# EAGLE design ChannelOutput-x2-opamp (EAGLE 6.5.0)

## Sheet 1 of 3
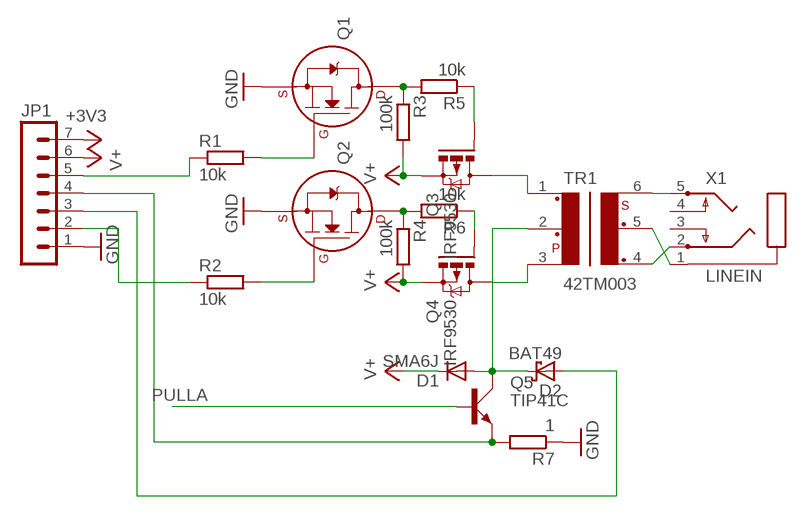
[diagram p0: schematic, sheet 1]

### Parts
D1  SMA6J  1N4004  [DO41-10]
D2  BAT49  [DO41-10]
JP1  MA07-1  [MA07-1]
Q1  2N7000_TO92  [TO-92]
Q2  2N7000_TO92  [TO-92]
Q3  IRF9530  [TO220BV]
Q4  IRF9530  [TO220BV]
Q5  TIP41C  [TO220AV]
R1  10k  R-EU_0207/2V  [0207/2V]
R2  10k  R-EU_0207/2V  [0207/2V]
R3  100k  R-EU_0204/5  [0204/5]
R4  100k  R-EU_0204/5  [0204/5]
R5  10k  R-EU_0207/2V  [0207/2V]
R6  10k  R-EU_0207/2V  [0207/2V]
R7  1  R-EU_0207/2V  [0207/2V]
TR1  42TM003  [42TM]
X1  LINEIN  PG203J  [PG203J]

### Nets
+3V3: JP1.7 ; also sheet 3
GND: JP1.1 Q1.1(S) Q2.1(S) R7.1 ; also sheet 2,3
N$1: Q1.2(G) R1.2
N$2: Q4.G R6.1
N$3: JP1.2 R2.1
N$4: JP1.5 R1.1
N$5: Q4.D TR1.3
N$6: Q3.D TR1.1
N$7: D2.A JP1.3
N$14: JP1.4 Q5.E R7.2
N$48: D1.A D2.C Q5.C TR1.2
N$65: TR1.6 X1.5
N$66: TR1.5 X1.1
N$67: TR1.4 X1.2
N$86: Q2.3(D) R4.1 R6.2
N$88: Q3.G R5.1
N$89: Q1.3(D) R3.1 R5.2
N$93: Q2.2(G) R2.2
PULLA: Q5.B ; also sheet 3
V+: D1.C JP1.6 Q3.S Q4.S R3.2 R4.2 ; also sheet 2
Unconnected: X1.3 X1.4

## Sheet 2 of 3
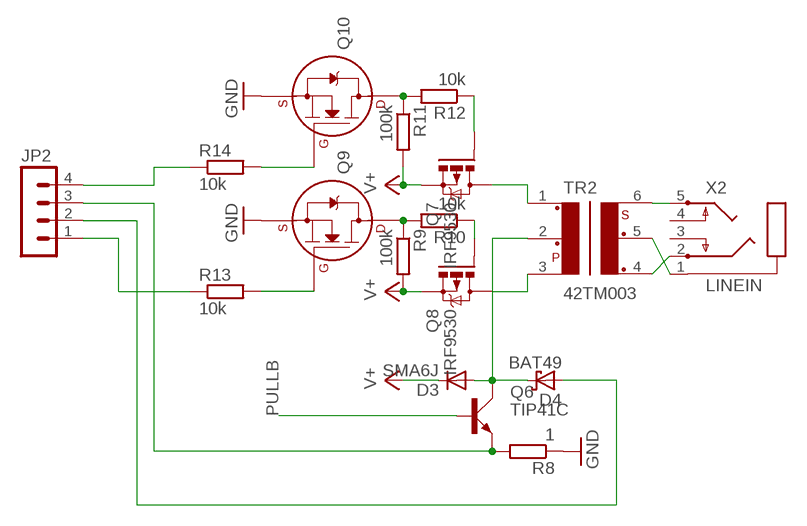
[diagram p1: schematic, sheet 2]

### Parts
D3  SMA6J  1N4004  [DO41-10]
D4  BAT49  [DO41-10]
JP2  MA04-1  [MA04-1]
Q6  TIP41C  [TO220AV]
Q7  IRF9530  [TO220BV]
Q8  IRF9530  [TO220BV]
Q9  2N7000_TO92  [TO-92]
Q10  2N7000_TO92  [TO-92]
R8  1  R-EU_0207/2V  [0207/2V]
R9  100k  R-EU_0204/5  [0204/5]
R10  10k  R-EU_0207/2V  [0207/2V]
R11  100k  R-EU_0204/5  [0204/5]
R12  10k  R-EU_0207/2V  [0207/2V]
R13  10k  R-EU_0207/2V  [0207/2V]
R14  10k  R-EU_0207/2V  [0207/2V]
TR2  42TM003  [42TM]
X2  LINEIN  PG203J  [PG203J]

### Nets
GND: Q9.1(S) Q10.1(S) R8.1 ; also sheet 1,3
N$8: D3.A D4.C Q6.C TR2.2
N$9: TR2.6 X2.5
N$10: TR2.5 X2.1
N$11: TR2.4 X2.2
N$12: JP2.3 Q6.E R8.2
N$13: Q9.3(D) R9.1 R10.2
N$15: Q7.G R12.1
N$16: Q10.3(D) R11.1 R12.2
N$17: Q9.2(G) R13.2
N$18: JP2.4 R14.1
N$19: Q8.G R10.1
N$20: Q10.2(G) R14.2
N$21: JP2.1 R13.1
N$23: Q8.D TR2.3
N$24: Q7.D TR2.1
N$25: D4.A JP2.2
PULLB: Q6.B ; also sheet 3
V+: D3.C Q7.S Q8.S R9.2 R11.2 ; also sheet 1
Unconnected: X2.3 X2.4

## Sheet 3 of 3
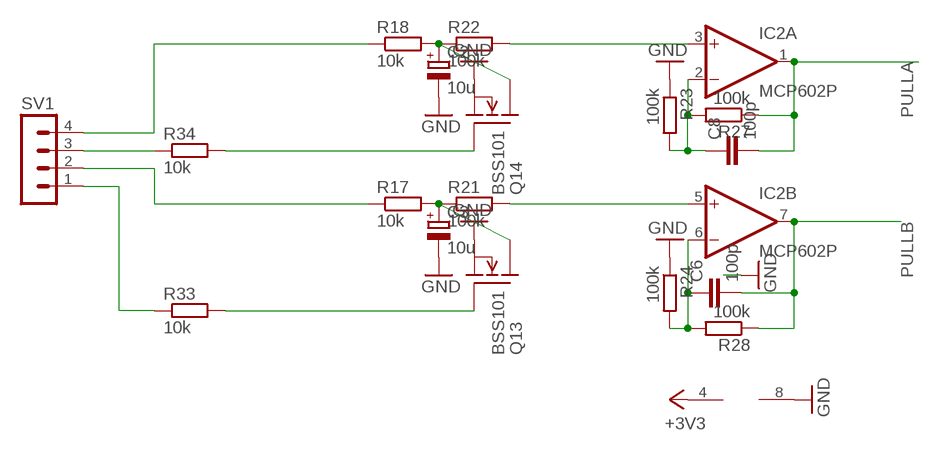
[diagram p2: schematic, sheet 3]

### Parts
C2  10u  CPOL-EUTT2D5  [TT2D5]
C3  10u  CPOL-EUTT2D5  [TT2D5]
C6  100p  C-EU025-024X044  [C025-024X044]
C8  100p  C-EU025-024X044  [C025-024X044]
IC2  MCP602P  [DIL08]
Q13  BSS101  [TO92]
Q14  BSS101  [TO92]
R17  10k  R-EU_0207/2V  [0207/2V]
R18  10k  R-EU_0207/2V  [0207/2V]
R21  100k  R-EU_0207/2V  [0207/2V]
R22  100k  R-EU_0207/2V  [0207/2V]
R23  100k  R-EU_0207/2V  [0207/2V]
R24  100k  R-EU_0207/2V  [0207/2V]
R27  100k  R-EU_0207/2V  [0207/2V]
R28  100k  R-EU_0207/2V  [0207/2V]
R33  10k  R-EU_0207/2V  [0207/2V]
R34  10k  R-EU_0207/2V  [0207/2V]
SV1  MA04-1  [MA04-1]

### Nets
+3V3: IC2.4(P:V-) ; also sheet 1
GND: C2.- C3.- IC2.8(P:V+) Q13.1(S) Q14.1(S) R23.1 R24.1 ; also sheet 1,2
N$26: R34.1 SV1.3
N$27: IC2.3(A:+IN) R22.2
N$28: R18.1 SV1.4
N$29: C6.1 IC2.6(B:-IN) R24.2 R28.2
N$31: R17.1 SV1.2
N$34: C8.1 IC2.2(A:-IN) R23.2 R27.2
N$38: Q14.2(G) R34.2
N$39: Q13.2(G) R33.2
N$43: R33.1 SV1.1
N$46: C2.+ Q14.3(D) R18.2 R22.1
N$47: C3.+ Q13.3(D) R17.2 R21.1
N$53: IC2.5(B:+IN) R21.2
PULLA: C8.2 IC2.1(A:OUT) R27.1 ; also sheet 1
PULLB: C6.2 IC2.7(B:OUT) R28.1 ; also sheet 2

## Library data of the parts
C2 C3 = rcl:CPOL-EU: POLARIZED CAPACITOR, European symbol
C6 C8 = resistor:C-EU: CAPACITOR, European symbol
D1 D3 = diode:1N4004: DIODE general purpose rectifier, 1 A
D2 D4 = diode:BAT49: DIODE small signal diode
IC2 = linear:MCP602: Single Op Amp 2.7V to 6.0V Single Supply CMOS Source: http://ww1.microchip.com/downloads/en/DeviceDoc/21314g.pdf
JP1 = con-lstb:MA07-1: PIN HEADER; OC_FARNELL: unknown; OC_NEWARK: unknown
JP2 SV1 = con-lstb:MA04-1: PIN HEADER; OC_FARNELL: unknown; OC_NEWARK: unknown
Q1 Q2 Q9 Q10 = transistors2:2N700*: 2N7000, 2N7002, NDS7002A N-channel enhancement mode MOSFET
Q3 Q4 Q7 Q8 = transistor-power:IRF9530: P-CHANNEL HEXFET POWER-MOS-FET Source: http://www.irf.com/product-info/datasheets/data/irf9530.pdf
Q5 Q6 = transistor-power:TIP41C: NPN TRANSISTOR
Q13 Q14 = transistor-fet:BSS101: N-Channel Enhancement MOSFET 200V; 0,16A; 11Ohm
R1-R14 R17 R18 R21-R24 R27 R28 R33 R34 = resistor:R-EU_: RESISTOR, European symbol
TR1 TR2 = trafo-xicon:42T?*: Xicon Micro-Mini EI-12 Audio Transformers 42TL/42TC/42TM Series Source: http://www.mouser.com//catalog/specsheets/164201.pdf http://www.mouser.com/catalog/specsheets/114225.pdf http://www.mouser.com/catalog/specsheets/164267.pdf; OC_FARNELL: unknown; OC_NEWARK: unknown
X1 X2 = con-hirschmann:PG203J: MIC/HEADPHONE JACK KS-S stereo microphone/headphone jack PG203JN (Schukat); OC_FARNELL: unknown; OC_NEWARK: unknown

## Net classes
0 default: width 0.305 mm, clearance 0.205 mm

## Board
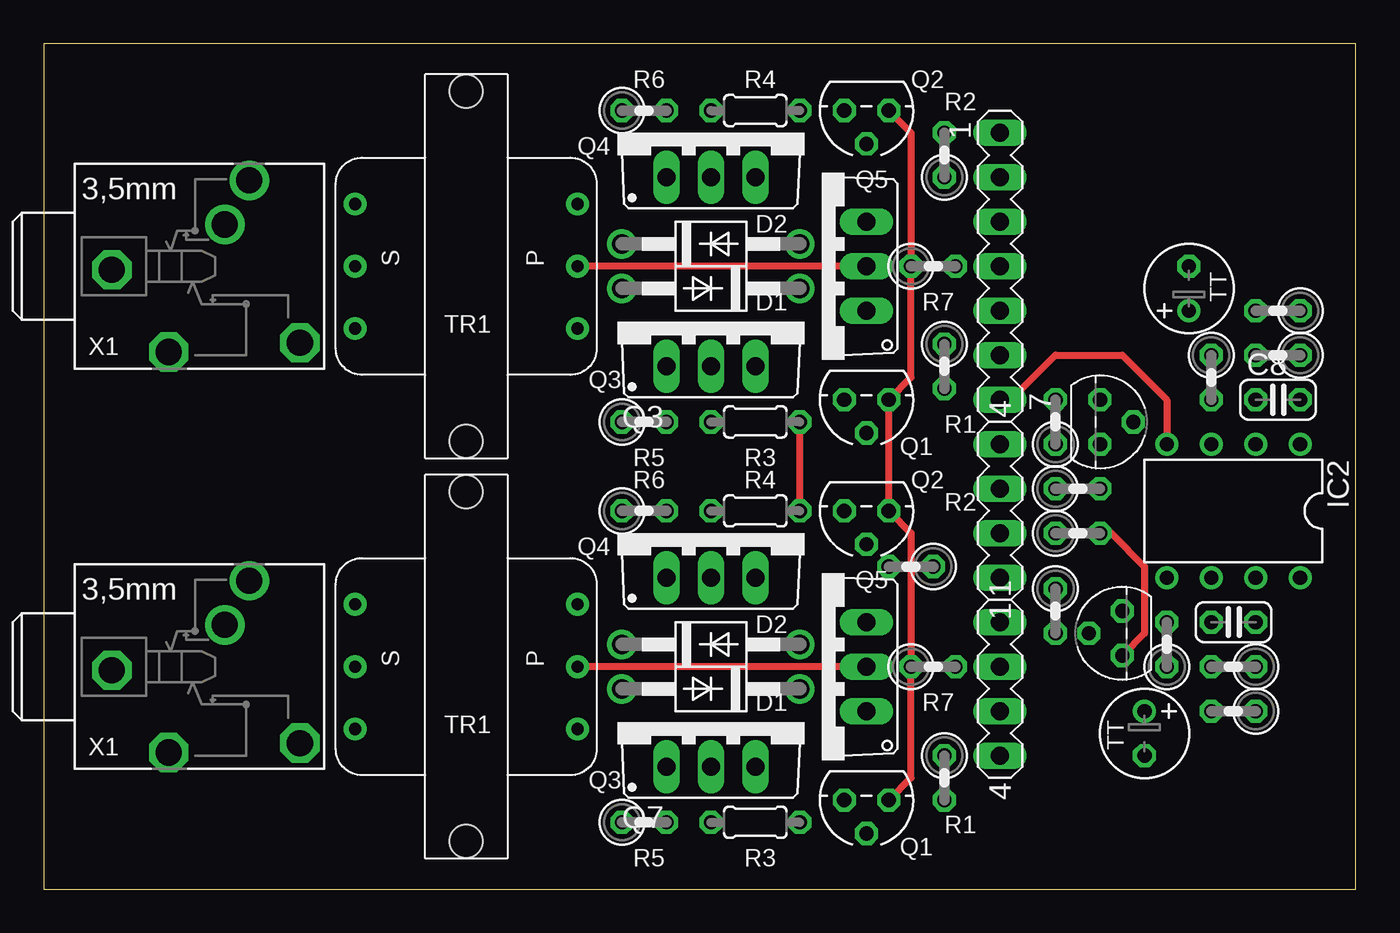
[diagram p3: board, top side]
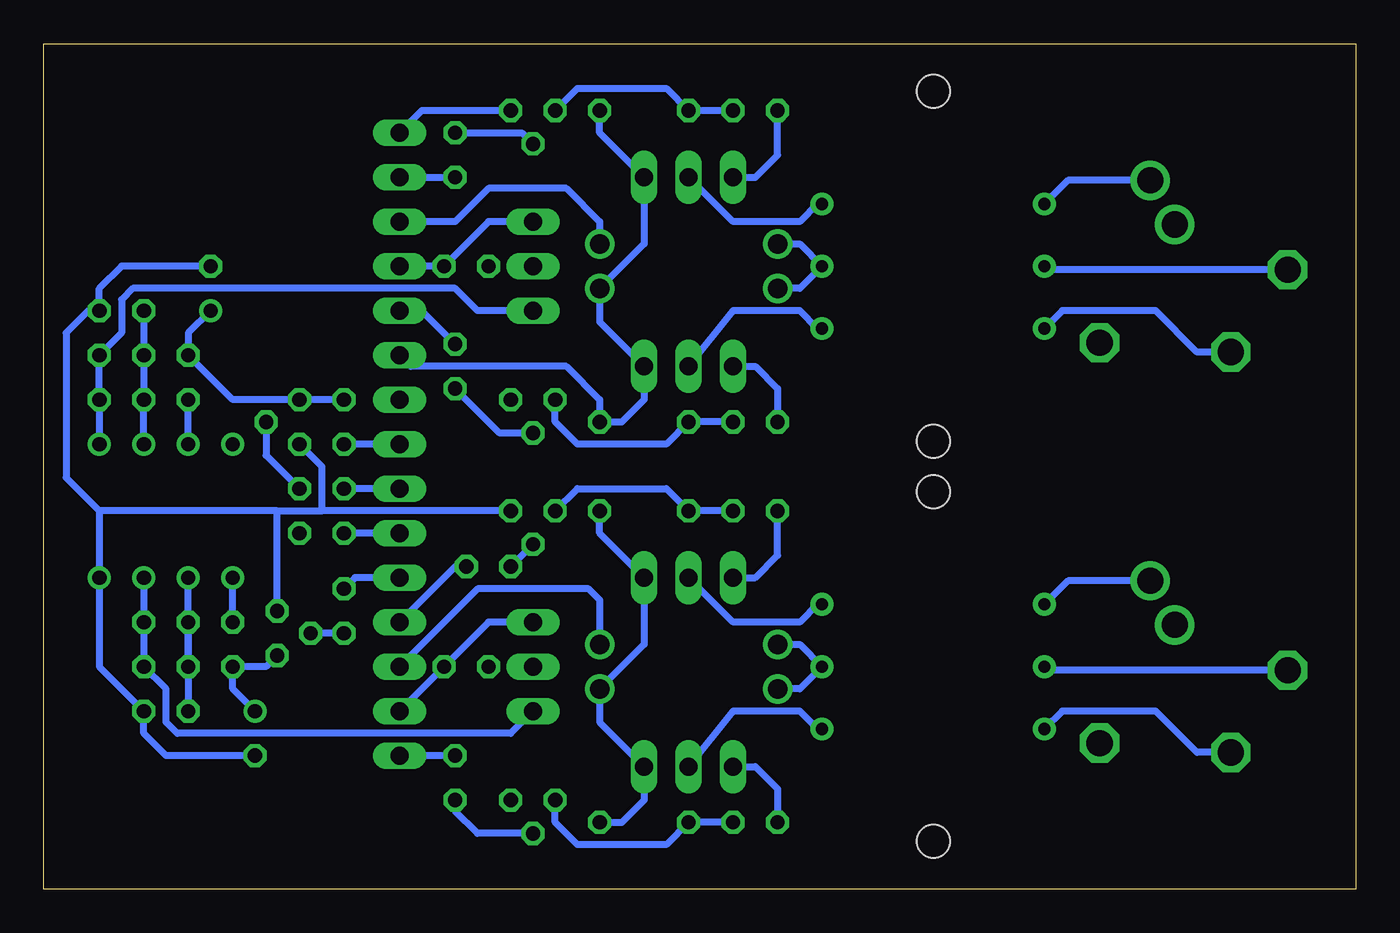
[diagram p4: board, bottom side, seen from below]

Size 74.93 x 48.26 mm. Coordinates in mm from the lower left corner, seen from the top.
Outline: 59.67,0 0,0 0,48.26 74.93,48.26 74.93,0 59.69,0
Copper layers (1*16): Top 0.035mm / dielectric 1.5mm / Bottom 0.035mm
Design rules "default": minimum track width 10mil, minimum drill 24mil, track to track 8mil, track to pad 8mil, pad to pad 8mil, via to via 8mil, smd to smd 8mil, copper to edge 40mil, drill to drill 8mil, minimum pad ring 10mil, minimum via ring 8mil, stop-mask expansion 4mil, vias tented up to drill 0mil, thermal gap 10mil

### Footprints (pad centres in the part's own frame; a part is rotated, then mirrored left to right if it is on the bottom)
TT2D5 = drill 0.813: + -1.27,0 | drill 0.813 octagon: - 1.27,0
C025-024X044 = drill 0.813 octagon: 1 -1.27,0; 2 1.27,0
DO41-10 = drill 1.118: A 5.08,0; C -5.08,0
DIL08 = drill 0.813 pad 1.27: 1 -3.81,-3.81; 2 -1.27,-3.81; 3 1.27,-3.81; 4 3.81,-3.81; 5 3.81,3.81; 6 1.27,3.81; 7 -1.27,3.81; 8 -3.81,3.81
MA07-1 = drill 1.016 long: 1 -7.62,0; 2 -5.08,0; 3 -2.54,0; 4 0,0; 5 2.54,0; 6 5.08,0; 7 7.62,0
MA04-1 = drill 1.016 long: 1 -3.81,0; 2 -1.27,0; 3 1.27,0; 4 3.81,0
TO-92 = drill 0.813 octagon: 1 -1.27,0; 2 0,1.905; 3 1.27,0
TO220BV = drill 1.016 long: D 0,-2.54; G -2.54,-2.54; S 2.54,-2.54
TO220AV = drill 1.016 long: B -2.54,-2.54; C 0,-2.54; E 2.54,-2.54
TO92 = drill 0.813 octagon: 1 1.27,0; 2 0,1.905; 3 -1.27,0
0207/2V = drill 0.813 octagon: 1 -1.27,0; 2 1.27,0
0204/5 = drill 0.813 octagon: 1 -2.54,0; 2 2.54,0
42TM = drill 0.7 pad 1.3: 1 -3.556,-6.35; 2 0,-6.35; 3 3.556,-6.35; 4 3.556,6.35; 5 0,6.35; 6 -3.556,6.35 | hole 1.9: -9.982,0; 9.982,0
PG203J = drill 1.499 octagon: 1 -5.004,-0.203; 4 5.74,-4.369; 5 -1.753,-4.902 | drill 1.499: 2 2.845,4.902; 3 1.448,2.388

### Placement (x,y rotation side)
C2  65.41,34.29 90 top
C3  62.87,8.89 270 top
C6  67.94,15.24 0 top
C8  70.48,27.94 0 top
D1  38.1,34.29 180 top
D2  38.1,36.83 0 top
D3  38.1,11.43 180 top
D4  38.1,13.97 0 top
IC2  67.94,21.59 180 top
JP1  54.61,35.56 270 top
JP2  54.61,11.43 270 top
Q1  46.99,27.94 180 top
Q2  46.99,44.45 180 top
Q3  38.1,32.38 0 top
Q4  38.1,43.18 0 top
Q5  44.45,35.56 90 top
Q6  44.45,12.7 90 top
Q7  38.1,9.53 0 top
Q8  38.1,20.32 0 top
Q9  46.99,21.59 180 top
Q10  46.99,5.08 180 top
Q13  61.59,14.61 90 top
Q14  60.33,26.67 270 top
R1  51.44,29.84 270 top
R2  51.44,41.91 90 top
R3  40.64,26.67 0 top
R4  40.64,44.45 0 top
R5  34.29,26.67 0 top
R6  34.29,44.45 0 top
R7  50.8,35.56 0 top
R8  50.8,12.7 0 top
R9  40.64,21.59 0 top
R10  34.29,21.59 0 top
R11  40.64,3.81 0 top
R12  34.29,3.81 0 top
R13  49.53,18.41 180 top
R14  51.44,6.35 270 top
R17  59.05,20.32 0 top
R18  57.78,26.67 90 top
R21  64.14,13.97 90 top
R22  66.67,29.21 270 top
R23  70.48,33.02 180 top
R24  67.94,10.16 180 top
R27  70.48,30.48 180 top
R28  67.94,12.7 180 top
R33  57.78,15.88 270 top
R34  59.05,22.86 0 top
SV1  54.61,21.59 90 top
TR1  24.13,35.56 90 top
TR2  24.13,12.7 90 top
X1  8.89,35.56 0 top
X2  8.89,12.7 0 top

### Tracks (layer width: path | path; a pad name or v marks a point on that pad's centre or on a via)
+3V3
  Top 0.406: JP1.7 55.24,27.94 57.78,30.48 61.59,30.48 64.14,27.94 IC2.4
GND
  Top 0.406: Q2.1 49.53,43.18 R7.1 49.53,29.21 Q1.1 Q9.1 49.53,20.32 R8.1 49.53,6.35 Q10.1
  Bottom 0.406: Q2.1 53.34,44.45 JP1.1 | C3.- 67.94,7.62 69.22,8.89 R24.1 71.75,12.7 IC2.8 71.75,21.59 | 71.75,21.59 73.66,23.5 73.66,31.75 72.39,33.02 R23.1 71.75,34.29 70.48,35.56 C2.- | Q9.1 59.05,21.59 | 61.59,21.59 71.75,21.59 | Q14.1 59.05,24.13 59.05,21.59 | Q13.1 61.59,21.59 | 61.59,21.59 59.05,21.59
N$1
  Bottom 0.406: Q1.2 48.9,26.04 R1.2
N$2
  Bottom 0.406: Q4.G 34.29,40.64 33.02,41.91 R6.1
N$3
  Bottom 0.406: JP1.2 R2.1
N$4
  Bottom 0.406: R1.1 53.34,33.02 JP1.5
N$5
  Bottom 0.406: TR1.3 30.73,39.12 31.75,38.1 35.56,38.1 Q4.D
N$6
  Bottom 0.406: TR1.1 30.73,32 31.75,33.02 35.56,33.02 Q3.D
N$7
  Bottom 0.406: D2.A 43.18,38.1 45.09,40.01 49.53,40.01 51.44,38.1 JP1.3
N$8
  Top 0.406: Q6.C TR2.2
  Bottom 0.406: D4.C 31.75,13.97 TR2.2 31.75,11.43 D3.A
N$9
  Bottom 0.406: X2.5 9.07,7.8 11.43,10.16 16.76,10.16 TR2.6
N$10
  Bottom 0.406: X2.1 17.58,12.5 TR2.5
N$11
  Bottom 0.406: X2.2 16.43,17.6 TR2.4
N$12
  Bottom 0.406: Q6.E 49.53,15.24 R8.2 JP2.3
N$13
  Bottom 0.406: R10.2 R9.1 39.37,22.86 44.45,22.86 Q9.3
N$14
  Bottom 0.406: Q5.E 49.53,38.1 R7.2 JP1.4
N$15
  Bottom 0.406: 33.02,4.45 R12.1 33.02,5.71 34.29,6.99 Q7.G
N$16
  Bottom 0.406: R12.2 R11.1 39.37,2.54 44.45,2.54 45.72,3.81 Q10.3
N$17
  Bottom 0.406: R13.2 Q9.2
N$18
  Bottom 0.406: R14.1 JP2.4
N$19
  Bottom 0.406: Q8.G 34.29,17.78 33.02,19.05 R10.1
N$20
  Bottom 0.406: Q10.2 50.16,3.17 51.44,4.45 R14.2
N$21
  Bottom 0.406: R13.1 51.44,18.41 JP2.1
N$23
  Bottom 0.406: TR2.3 30.73,16.26 31.75,15.24 35.56,15.24 Q8.D
N$24
  Bottom 0.406: TR2.1 30.73,9.14 31.75,10.16 35.56,10.16 Q7.D
N$25
  Bottom 0.406: D4.A 43.18,16.51 43.81,17.14 50.16,17.14 JP2.2
N$26
  Bottom 0.406: SV1.3 R34.1
N$27
  Bottom 0.406: IC2.3 R22.2
N$28
  Bottom 0.406: SV1.4 R18.1
N$29
  Bottom 0.406: C6.1 R28.2 | R28.2 IC2.6 | R28.2 R24.2
N$31
  Bottom 0.406: SV1.2 R17.1
N$34
  Bottom 0.406: R23.2 R27.2 C8.1 IC2.2
N$38
  Bottom 0.406: Q14.2 62.23,24.77 R34.2
N$39
  Bottom 0.406: R33.2 Q13.2
N$43
  Bottom 0.406: SV1.1 57.15,17.78 R33.1
N$46
  Bottom 0.406: R18.2 Q14.3 64.14,27.94 R22.1 66.67,31.75 C2.+
N$47
  Top 0.406: R17.2 60.96,20.32 62.87,18.41 62.87,14.61 Q13.3
  Bottom 0.406: C3.+ 64.14,11.43 R21.1 62.23,12.7 Q13.3
N$48
  Top 0.406: Q5.C TR1.2
  Bottom 0.406: D2.C 31.75,36.83 TR1.2 31.75,34.29 D1.A
N$53
  Bottom 0.406: R21.2 IC2.5
N$65
  Bottom 0.406: X1.5 9.07,30.66 11.43,33.02 16.76,33.02 TR1.6
N$66
  Bottom 0.406: X1.1 17.58,35.36 TR1.5
N$67
  Bottom 0.406: X1.2 16.43,40.46 TR1.4
N$86
  Bottom 0.406: R6.2 R4.1 39.37,45.72 44.45,45.72 Q2.3
N$88
  Bottom 0.406: 33.02,27.3 R5.1 33.02,28.57 34.29,29.84 Q3.G
N$89
  Bottom 0.406: R5.2 R3.1 39.37,25.4 44.45,25.4 45.72,26.67 Q1.3
N$93
  Bottom 0.406: Q2.2 47.62,43.18 R2.2
PULLA
  Bottom 0.406: IC2.1 C8.2 R27.1 70.48,31.75 70.48,33.66 69.85,34.29 51.44,34.29 50.16,33.02 Q5.B
PULLB
  Bottom 0.406: IC2.7 C6.2 R28.1 67.94,11.43 67.94,9.53 67.31,8.89 48.26,8.89 Q6.B
V+
  Top 0.406: R9.2 R3.2
  Bottom 0.406: R4.2 43.18,43.18 Q4.S 40.64,36.83 D1.C 43.18,32.38 Q3.S 40.64,27.94 41.91,26.67 R3.2 43.18,27.94 45.09,29.84 53.98,29.84 JP1.6 | R9.2 43.18,20.32 Q8.S 40.64,13.97 D3.C 43.18,9.53 Q7.S 40.64,5.08 41.91,3.81 R11.2

### Text on the board
tNames: R6 | R4 | Q2 | R2 | Q4 | Q5 | D2 | D1 | R7 | TR1 | X1 | Q3 | R1 | Q1 | R5 | R3 | R6 | R4 | Q2 | R2 | Q4 | Q5 | D2 | D1 | R7 | TR1 | X1 | Q3 | R1 | Q1 | R5 | R3